# Altium schematic sheet ATMega328P-PU.SchDoc
size A
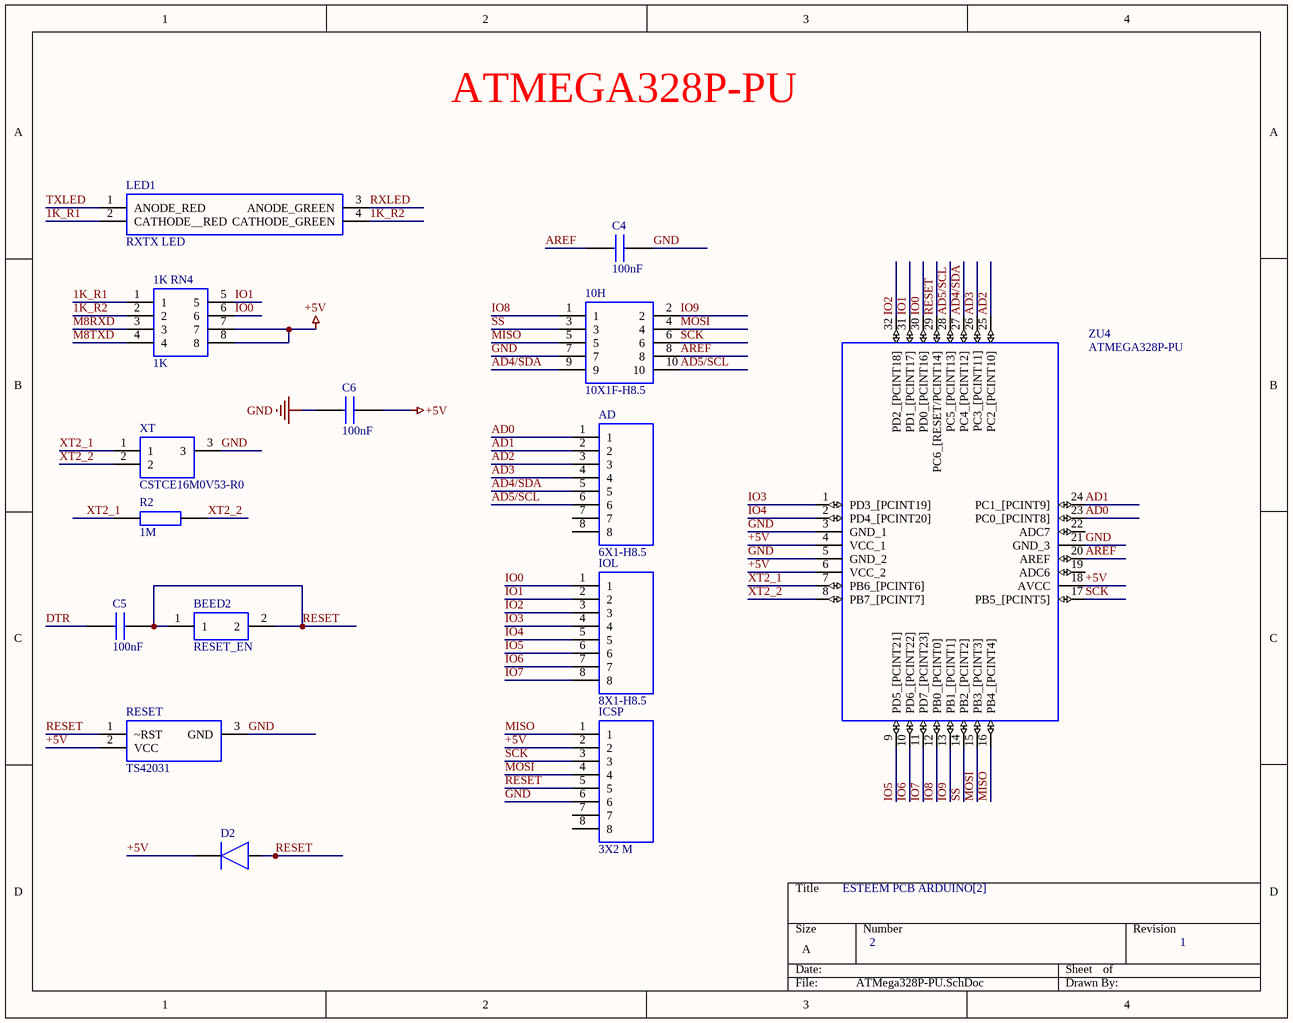
[diagram p0: ATMega328P-PU.SchDoc]

## Parts
1K_RN4  1K  [CAY10-XXXJ4]
10H  10X1F-H8.5  [FTMH10503LDV]
AD  6X1-H8.5  [HDRV8W90P0X254_1X8_2032X249X560P]
BEED2  RESET_EN  [BEADC2012X105N]
C4  100nF  [CAPC2012X130N]
C5  100nF  [CAPC2012X130N]
C6  100nF  [CAPC2012X130N]
D2  CD1206-S01575  [DIOC3016X65N]  (value not drawn)
ICSP  3X2 M  [HDRV8W90P0X254_1X8_2032X249X560P]
IOL  8X1-H8.5  [HDRV8W90P0X254_1X8_2032X249X560P]
LED1  RXTX LED  [SML522MD8WT86]
R2  1M  [RESC1608X55N]
RESET  TS42031  [SOT95P240X110-3N]
XT  CSTCE16M0V53-R0  [CSTCE-V]
ZU4  ATMEGA328P-PU  [QFP80P900X900X120-32N]

## Nets
+5V: 1K_RN4.7 1K_RN4.8 C6.2 D2.1(K) ICSP.2 RESET.2(VCC) ZU4.4(VCC_1) ZU4.6(VCC_2) ZU4.18(AVCC)
GND: 10H.7 C4.2 C6.1 ICSP.6 RESET.3(GND) XT.3 ZU4.3(GND_1) ZU4.5(GND_2) ZU4.21(GND_3)
1K_R1: 1K_RN4.1 LED1.2(CATHODE__RED)
1K_R2: 1K_RN4.2 LED1.4(CATHODE_GREEN)
AD0: AD.1 ZU4.23(PC0_[PCINT8])
AD1: AD.2 ZU4.24(PC1_[PCINT9])
AD2: AD.3 ZU4.25(PC2_[PCINT10])
AD3: AD.4 ZU4.26(PC3_[PCINT11])
AD4/SDA: 10H.9 AD.5 ZU4.27(PC4_[PCINT12])
AD5/SCL: 10H.10 AD.6 ZU4.28(PC5_[PCINT13])
AREF: 10H.8 C4.1 ZU4.20(AREF)
DTR: C5.1
IO0: 1K_RN4.6 IOL.1 ZU4.30(PD0_[PCINT16])
IO1: 1K_RN4.5 IOL.2 ZU4.31(PD1_[PCINT17])
IO2: IOL.3 ZU4.32(PD2_[PCINT18])
IO3: IOL.4 ZU4.1(PD3_[PCINT19])
IO4: IOL.5 ZU4.2(PD4_[PCINT20])
IO5: IOL.6 ZU4.9(PD5_[PCINT21])
IO6: IOL.7 ZU4.10(PD6_[PCINT22])
IO7: IOL.8 ZU4.11(PD7_[PCINT23])
IO8: 10H.1 ZU4.12(PB0_[PCINT0])
IO9: 10H.2 ZU4.13(PB1_[PCINT1])
M8RXD: 1K_RN4.3
M8TXD: 1K_RN4.4
MISO: 10H.5 ICSP.1 ZU4.16(PB4_[PCINT4])
MOSI: 10H.4 ICSP.4 ZU4.15(PB3_[PCINT3])
RESET: BEED2.1 BEED2.2 C5.2 D2.2(A) ICSP.5 RESET.1(~RST) ZU4.29(PC6_[RESET/PCINT14])
RXLED: LED1.3(ANODE_GREEN)
SCK: 10H.6 ICSP.3 ZU4.17(PB5_[PCINT5])
SS: 10H.3 ZU4.14(PB2_[PCINT2])
TXLED: LED1.1(ANODE_RED)
XT2_1: R2.1 XT.1 ZU4.7(PB6_[PCINT6])
XT2_2: R2.2 XT.2 ZU4.8(PB7_[PCINT7])

Not connected (* = marked no-connect by the designer): AD 7 8; ICSP 7 8; ZU4 19(ADC6) 22(ADC7)

## Notes on the sheet
- ATMEGA328P-PU
- ESTEEM PCB ARDUINO[2]
- 2
- 1

## Library data of the parts
1K_RN4 = CAY10-220J4LF: CAY10 convex chip resistor array,22R Bourns CAY10 Series 22 5% Isolated SMT Resistor Array, 4 Resistors, 0.125W total 0804 package Convex; Allied_Number: 70276318; Manufacturer_Name: Bourns; Manufacturer_Part_Number: CAY10-220J4LF; RS Part Number: 1674746; RS Price/Stock: http://uk.rs-online.com/web/p/products/1674746; Allied Price/Stock: https://www.alliedelec.com/bourns-cay10-220j4lf/70276318/; Mouser Part Number: 652-CAY10-220J4LF; Mouser Price/Stock: https://www.mouser.com/Search/Refine.aspx?Keyword=652-CAY10-220J4LF; Datasheet Link: http://docs-emea.rs-online.com/webdocs/064e/0900766b8064e463.pdf
10H = FTMH-105-03-L-DV: Header 1mm PCB SMT vertical 10way Samtec FTMH Series, 1mm Pitch 10 Way 2 Row Straight Pin Header, Surface Mount, Solder Termination; Manufacturer_Name: SAMTEC; Manufacturer_Part_Number: FTMH-105-03-L-DV; RS Part Number: 7668984P; RS Price/Stock: http://uk.rs-online.com/web/p/products/7668984P; Mouser Part Number: 200-FTMH10503LDV; Mouser Price/Stock: https://www.mouser.com/Search/Refine.aspx?Keyword=200-FTMH10503LDV; Datasheet Link: http://suddendocs.samtec.com/prints/ftmh-1xx-xx-xx-dv-xx-mkt.pdf
AD ICSP IOL = 90120-0768: 8 way single row straight header Molex C-GRID III Series, Series Number 90120, 2.54mm Pitch 8 Way 1 Row Straight Pin Header, Through Hole; Allied_Number: 70372836; Geometry.Height: 5.6mm; Manufacturer_Name: Molex; Manufacturer_Part_Number: 90120-0768; RS Part Number: 1671900; RS Price/Stock: http://uk.rs-online.com/web/p/products/1671900; Allied Price/Stock: https://www.alliedelec.com/molex-incorporated-90120-0768/70372836/; Mouser Part Number: 538-90120-0768; Mouser Price/Stock: https://www.mouser.com/Search/Refine.aspx?Keyword=538-90120-0768; Datasheet Link: http://www.molex.com/molex/products/datasheet.jsp?part=active/0901200768_PCB_HEADERS.xml
BEED2 = BLM21BD601SH1D: Chip Ferrite Bead 600R 0805 300mA 1LN; Manufacturer_Name: Murata Electronics; Geometry.Height: 1.05mm; Manufacturer_Part_Number: BLM21BD601SH1D; RS Part Number: 1048541P; RS Price/Stock: http://uk.rs-online.com/web/p/products/1048541P; Mouser Part Number: 81-BLM21BD601SH1D; Mouser Price/Stock: https://www.mouser.com/Search/Refine.aspx?Keyword=81-BLM21BD601SH1D; Datasheet Link: https://componentsearchengine.com/Datasheets/2/BLM21BD601SH1D.pdf
C4-C6 = 0805Y0500104KXT: Syfer Technology 0805 Flexicap 100nF Ceramic Multilayer Capacitor, 50 V, +125C, X7R Dielectric, 10% SMD; Geometry.Height: 1.3mm; Manufacturer_Name: Syfer; Manufacturer_Part_Number: 0805Y0500104KXT; RS Part Number: 7738389P; RS Price/Stock: http://uk.rs-online.com/web/p/products/7738389P; Mouser Part Number: 7738389P; Mouser Price/Stock: http://uk.rs-online.com/web/p/products/7738389P; Datasheet Link: http://docs-emea.rs-online.com/webdocs/119d/0900766b8119d7bc.pdf
D2 = CD1206-S01575: Diode Switching 100V 0.15A 4ns SMD1206 Bourns CD1206-S01575 Switching Diode, 150mA, 100V, 4ns, 2-Pin 1206; Allied_Number: 70154675; Geometry.Height: 0.65mm; Manufacturer_Name: Bourns; Manufacturer_Part_Number: CD1206-S01575; RS Part Number: 1775431; RS Price/Stock: http://uk.rs-online.com/web/p/products/1775431; Allied Price/Stock: http://www.alliedelec.com/bourns-cd1206-s01575/70154675/; Mouser Part Number: 652-CD1206-S01575; Mouser Price/Stock: https://www.mouser.com/Search/Refine.aspx?Keyword=652-CD1206-S01575; Datasheet Link: http://docs-emea.rs-online.com/webdocs/1189/0900766b811897a9.pdf
LED1 = SML-522MU8WT86: Dual color mini-mold Chip LED: ROHM's chip LED lineup consists of standard type,top-view type, side-view type and reverse-mount type.; Manufacturer_Name: ROHM Semiconductor; Geometry.Height: 0mm; Manufacturer_Part_Number: SML-522MU8WT86; RS Part Number: 1682468; RS Price/Stock: http://uk.rs-online.com/web/p/products/1682468; Mouser Part Number: 755-SML-522MU8WT86; Mouser Price/Stock: https://www.mouser.com/Search/Refine.aspx?Keyword=755-SML-522MU8WT86; Datasheet Link: https://www.rohm.com/datasheet/SML-522MU8W/sml-52-e
R2 = CPF0603B1M0E1: TE CONNECTIVITY - CPF0603B1M0E1 - RES, THIN FILM, 1M, 0.1%, 0.063W, 0603; Geometry.Height: 0.55mm; Manufacturer_Name: TE Connectivity; Manufacturer_Part_Number: CPF0603B1M0E1; RS Part Number: *; RS Price/Stock: *; Mouser Part Number: 279-CPF0603B1M0E1; Mouser Price/Stock: https://www.mouser.com/Search/Refine.aspx?Keyword=279-CPF0603B1M0E1; Datasheet Link: http://www.farnell.com/datasheets/1786775.pdf
RESET = DS1818R-5+: 3.3V EconoReset with Pushbutton; Manufacturer_Name: Maxim Integrated; Manufacturer_Part_Number: DS1818R-5+; RS Part Number: *; RS Price/Stock: *; Mouser Part Number: *; Mouser Price/Stock: *; Datasheet Link: *
XT = CSTCE16M0V53-R0: Ceramic resonator SMT CSTCE 16.00MHz CSTCE16M0V53-R0, Ceramic Resonator, 16MHz Expander 15pF, 3-Pin Cap Chip, 3.2 x 1.3 x 0.9mm; Manufacturer_Name: Murata Electronics; Manufacturer_Part_Number: CSTCE16M0V53-R0; RS Part Number: 7926524P; RS Price/Stock: http://uk.rs-online.com/web/p/products/7926524P; Mouser Part Number: 81-CSTCE16M0V53-R0; Mouser Price/Stock: https://www.mouser.com/Search/Refine.aspx?Keyword=81-CSTCE16M0V53-R0; Datasheet Link: http://uk.rs-online.com/web/p/products/6241077
ZU4 = ATMEGA328P-AU: MICROCHIP - ATMEGA328P-AU. - MICROCONTROLLER MCU, 8 BIT, ATMEGA, 20MHZ, TQFP-32; Geometry.Height: 1.2mm; Manufacturer_Name: Microchip; Manufacturer_Part_Number: ATMEGA328P-AU; RS Part Number: 1310271; RS Price/Stock: http://uk.rs-online.com/web/p/products/1310271; Mouser Part Number: 556-ATMEGA328P-AU; Mouser Price/Stock: https://www.mouser.com/Search/Refine.aspx?Keyword=556-ATMEGA328P-AU; Datasheet Link: https://componentsearchengine.com/Datasheets/2/ATMEGA328P-AU.pdf